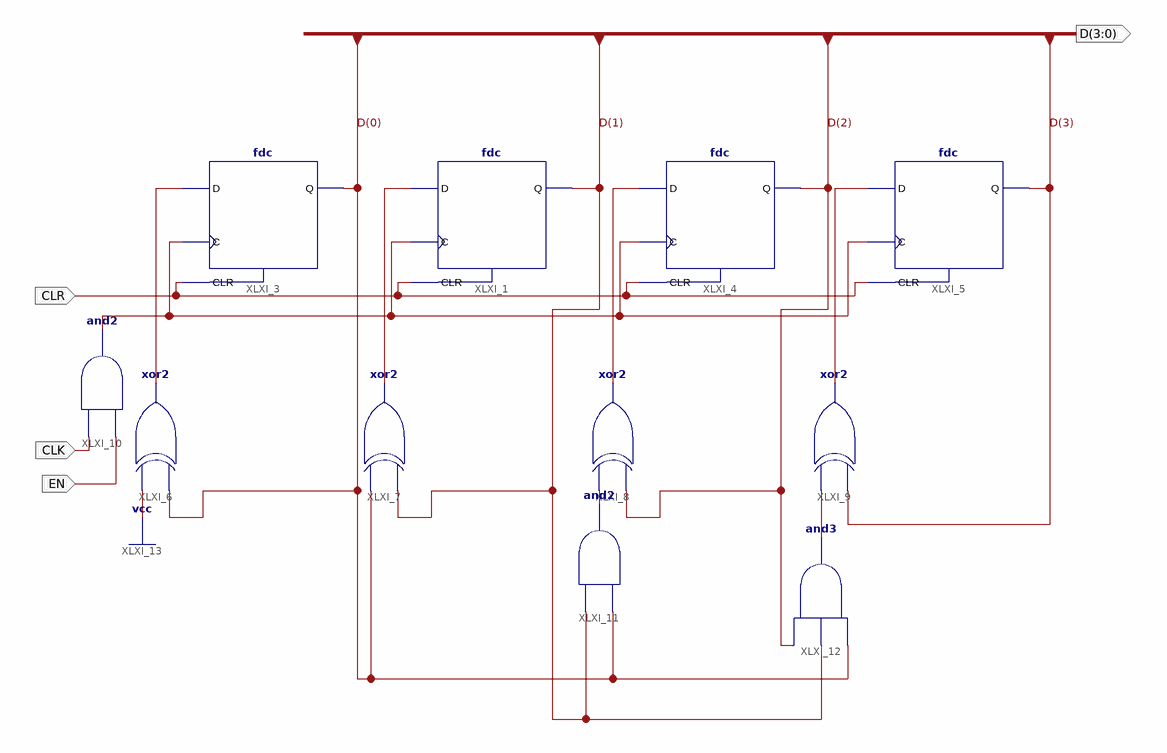
[diagram p0: schematic sheet 1]
// Xilinx ISE schematic counter163.sch (spartan3e) as structural Verilog: 11 symbols, 4 ports
module counter163 (
  input  CLR,
  input  CLK,
  input  EN,
  output [3:0] D
);

  wire XLXN_9, XLXN_10, XLXN_16, XLXN_19, XLXN_20, XLXN_26, XLXN_27;

  fdc XLXI_1 (.C(XLXN_9), .CLR(CLR), .D(XLXN_16), .Q(D[1]));
  fdc XLXI_3 (.C(XLXN_9), .CLR(CLR), .D(XLXN_10), .Q(D[0]));
  fdc XLXI_4 (.C(XLXN_9), .CLR(CLR), .D(XLXN_20), .Q(D[2]));
  fdc XLXI_5 (.C(XLXN_9), .CLR(CLR), .D(XLXN_27), .Q(D[3]));
  xor XLXI_6 (XLXN_10, D[0], 1'b1);
  xor XLXI_7 (XLXN_16, D[1], D[0]);
  xor XLXI_8 (XLXN_20, D[2], XLXN_19);
  xor XLXI_9 (XLXN_27, D[3], XLXN_26);
  and XLXI_10 (XLXN_9, EN, CLK);
  and XLXI_11 (XLXN_19, D[0], D[1]);
  and XLXI_12 (XLXN_26, D[0], D[1], D[2]);
endmodule
